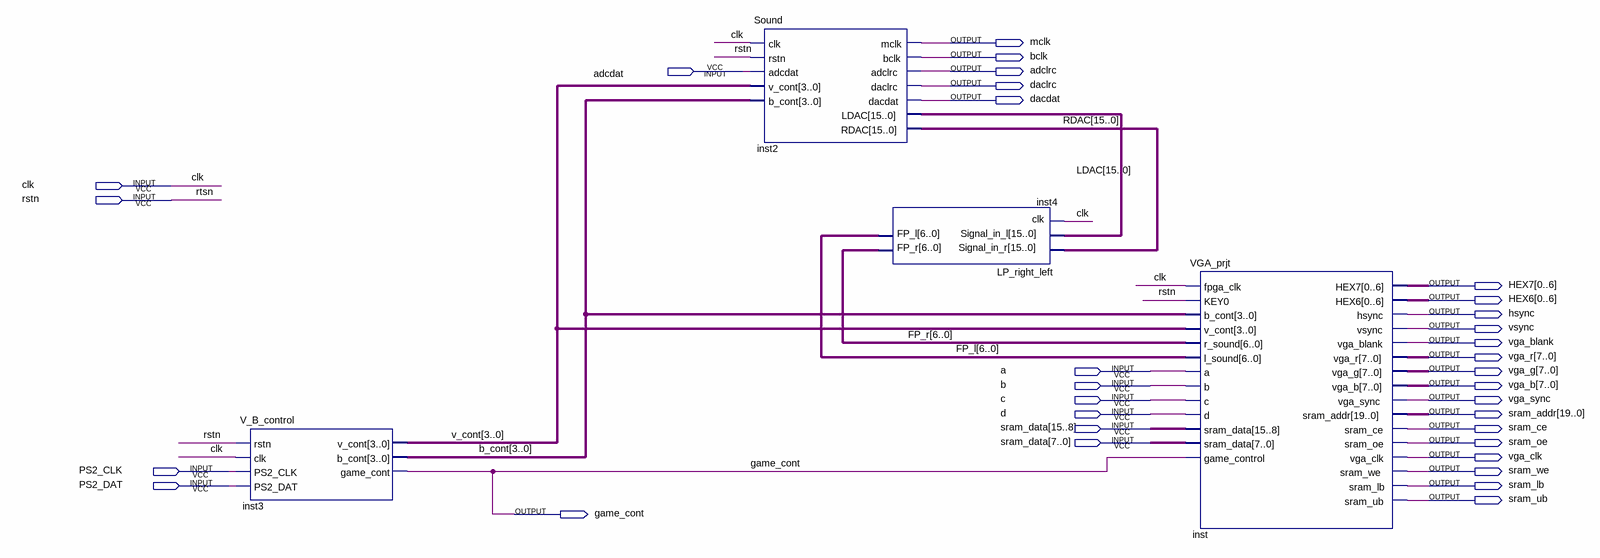
[diagram p0: schematic sheet]
// Quartus schematic Grp_6_project.bdf as structural Verilog: 4 symbols, 33 pins
module Grp_6_project (
  input  adcdat,
  input  clk,
  input  rstn,
  input  a,
  input  b,
  input  c,
  input  d,
  input  [15:0] sram_data,
  input  PS2_CLK,
  input  PS2_DAT,
  output mclk,
  output bclk,
  output adclrc,
  output daclrc,
  output dacdat,
  output [0:6] HEX7,
  output [0:6] HEX6,
  output hsync,
  output vsync,
  output vga_blank,
  output [7:0] vga_r,
  output [7:0] vga_g,
  output [7:0] vga_b,
  output vga_sync,
  output [19:0] sram_addr,
  output sram_ce,
  output sram_oe,
  output vga_clk,
  output sram_we,
  output sram_lb,
  output sram_ub,
  output game_cont
);

  wire [3:0] b_cont, v_cont;
  wire [6:0] FP_l, FP_r;
  wire [15:0] LDAC, RDAC;

  V_B_control inst3 (
    .rstn(rstn), .clk(clk), .PS2_CLK(PS2_CLK), .PS2_DAT(PS2_DAT), .v_cont(v_cont), .b_cont(b_cont),
    .game_cont(game_cont));
  Sound inst2 (
    .clk(clk), .rstn(rstn), .adcdat(adcdat), .v_cont(v_cont), .b_cont(b_cont), .mclk(mclk), .bclk(bclk),
    .adclrc(adclrc), .daclrc(daclrc), .dacdat(dacdat), .LDAC(LDAC), .RDAC(RDAC));
  LP_right_left inst4 (.Signal_in_r(RDAC), .Signal_in_l(LDAC), .clk(clk), .FP_r(FP_r), .FP_l(FP_l));
  VGA_prjt inst (
    .fpga_clk(clk), .KEY0(rstn), .b_cont(b_cont), .v_cont(v_cont), .r_sound(FP_r), .l_sound(FP_l), .a(a),
    .b(b), .c(c), .d(d), .sram_data(sram_data), .game_control(game_cont), .HEX7(HEX7), .HEX6(HEX6),
    .hsync(hsync), .vsync(vsync), .vga_blank(vga_blank), .vga_r(vga_r), .vga_g(vga_g), .vga_b(vga_b),
    .vga_sync(vga_sync), .sram_addr(sram_addr), .sram_ce(sram_ce), .sram_oe(sram_oe), .vga_clk(vga_clk),
    .sram_we(sram_we), .sram_lb(sram_lb), .sram_ub(sram_ub));

  // Other names for the same wires on the sheet: rtsn = rstn
endmodule
